# Altium schematic sheet Sheet1.SchDoc
size Letter; SheetNumber: 1; SheetTotal: 5
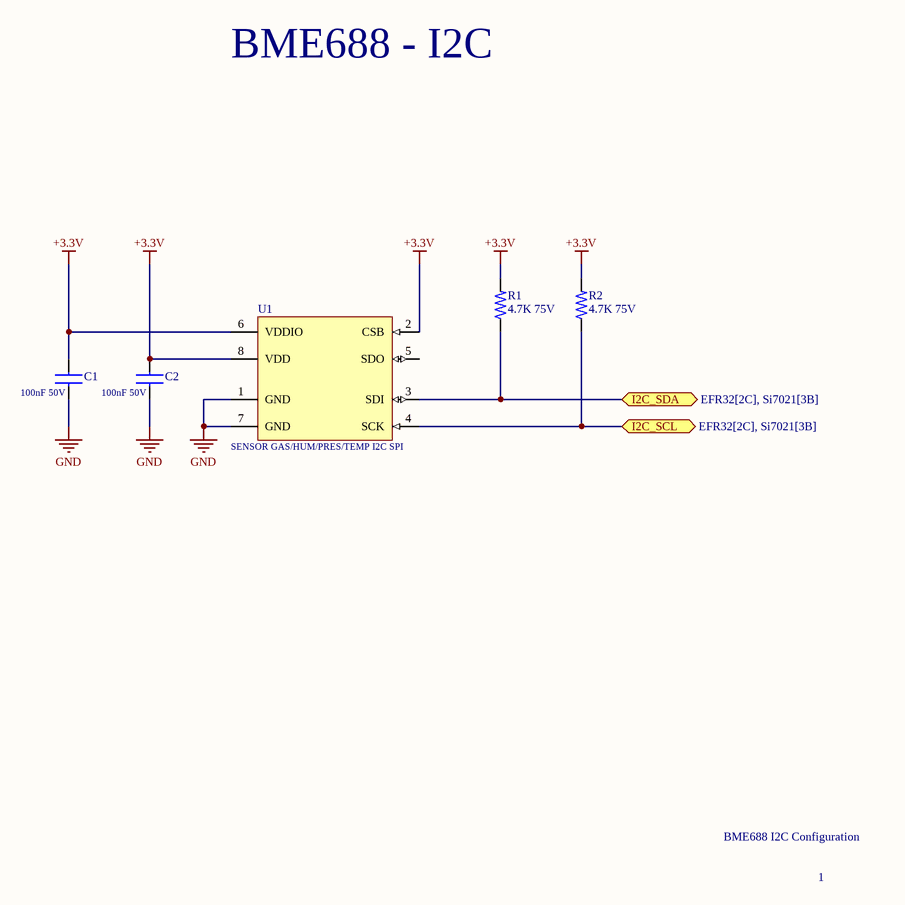
[diagram p0: Sheet1.SchDoc]

## Parts
C1  100nF 50V  [CAP_0603_1MM]
C2  100nF 50V  [CAP_0603_1MM]
R1  4.7K 75V  [RES_0603_1608X06]
R2  4.7K 75V  [RES_0603_1608X06]
U1  SENSOR GAS/HUM/PRES/TEMP I2C SPI  [LGA_8_300X300X100]

## Ports
I2C_SCL (bidir, see EFR32[2C], Si7021[3B]), I2C_SDA (bidir, see EFR32[2C], Si7021[3B])

## Nets
+3.3V: C1.1 C2.1 R1.2 R2.2 U1.2(CSB) U1.6(VDDIO) U1.8(VDD)
GND: C1.2 C2.2 U1.1(GND) U1.7(GND)
I2C_SCL: R2.1 U1.4(SCK) ; port I2C_SCL
I2C_SDA: R1.1 U1.3(SDI) ; port I2C_SDA

Not connected (* = marked no-connect by the designer): U1 5(SDO)

## Notes on the sheet
- BME688 - I2C
- BME688 I2C Configuration
- 1

## Library data of the parts
C1 C2 = CC0603ZRY5V9BB104: Ceramic Capacitor, Multilayer, Ceramic, 50V, 80% +Tol, 20% -Tol, Y5V, -82/+22% TC, 0.1uF, Surface Mount, 0603; Manufacturer: Yageo; Multilayer: Yes; Supplier: Digikey; Supplier Part Number: 311-1343-1-ND; Manufacturer Part Number: CC0603ZRY5V9BB104; RoHS: Yes; Category: Ceramic Capacitors; Stock: 7870307; Pricing: 1=0.1, 10=0.028, 50=0.0162, 100=0.0125, 500=0.00944, 1000=0.00742 (USD); Mounting Technology: Surface Mount; Pins: 2; Dielectric Material: Ceramic; Package Shape: Rectangular; Case/Package: 0603; Terminal Finish: Nickel; Min Operating Temperature: -30°C; Max Operating Temperature: 85°C; JESD-609 Code: e3; Value: 100nF; Capacitor Type: Ceramic; Tolerance  (fill in as +-): 20%; Package Style: SMTMeter; Packaging: Tape and Reel; Tolerance (fill in as +-): 80%; Rated DC Voltage (URdc): 50V; Temperature Characteristics Code: Y5V; Termination: Wraparound; Length: 1.6mm; Width: 0.8mm; Height: 0.8mm; Reach SVHC Compliant: Yes; RoHS Compliant: Yes; ComponentLink1URL: https://datasheet.ciiva.com:443/pdfs/VipMasterIC/IC/YAGO/YAGO-S-A0004841839/YAGO-S-A0004841839-1.pdf?src-supplier=IHS+Markit; ComponentLink1Description: https://datasheet.ciiva.com:443/pdfs/VipMasterIC/IC/YAGO/YAGO-S-A0004841839/YAGO-S-A0004841839-1.pdf?src-supplier=IHS+Markit; ComponentLink2URL: https://datasheet.ciiva.com/144/mlccorderingcode-144027.pdf?src-supplier=Digikey; ComponentLink2Description: https://datasheet.ciiva.com/144/mlccorderingcode-144027.pdf?src-supplier=Digikey; ComponentLink3URL: https://datasheet.ciiva.com/11786/0900766b8079c870-11786029.pdf?src-supplier=Rs; ComponentLink3Description: https://datasheet.ciiva.com/11786/0900766b8079c870-11786029.pdf?src-supplier=Rs; ComponentLink4URL: https://datasheet.ciiva.com/144/mlccorderingcode-144025.pdf?src-supplier=Digikey; ComponentLink4Description: https://datasheet.ciiva.com/144/mlccorderingcode-144025.pdf?src-supplier=Digikey; ComponentLink5URL: https://datasheet.ciiva.com/144/mlccorderingcode-144026.pdf?src-supplier=Digikey; ComponentLink5Description: https://datasheet.ciiva.com/144/mlccorderingcode-144026.pdf?src-supplier=Digikey; ComponentLink6URL: https://datasheet.ciiva.com/5427/upy-gphc-y5v-6-3v-to-50v-5-5427420.pdf?src-supplier=Mouser; ComponentLink6Description: https://datasheet.ciiva.com/5427/upy-gphc-y5v-6-3v-to-50v-5-5427420.pdf?src-supplier=Mouser; ComponentLink7URL: https://datasheet.ciiva.com/28450/1132289-28450702.pdf?src-supplier=Element14; ComponentLink7Description: https://datasheet.ciiva.com/28450/1132289-28450702.pdf?src-supplier=Element14; ComponentLink8URL: https://datasheet.ciiva.com/26829/getdatasheetpartid-403611-26829467.pdf?src-supplier=Verical; ComponentLink8Description: https://datasheet.ciiva.com/26829/getdatasheetpartid-403611-26829467.pdf?src-supplier=Verical
R1 R2 = RMCF0603FT4K70: Fixed Resistor, Metal Glaze/thick Film, 0.1W, 4700ohm, 75V, 1% +/-Tol, 100ppm/Cel, Surface Mount, 0603; Manufacturer: Stackpole Electronics; Power: 100mW; Rated Temperature: 70°C; Value: 4.7kR; Temperature Coefficient: 100ppm/°C; Package Height: 0.45mm; Package Length: 1.55mm; Package Width: 0.8mm; Reference Standard: AEC-Q200; Supplier: Digikey; Supplier Part Number: RMCF0603FT4K70CT-ND; Manufacturer Part Number: RMCF0603FT4K70; RoHS: Yes; Category: Chip SMD Resistors; Stock: 2225898; Pricing: 1=0.1, 10=0.015, 50=0.009, 100=0.0075, 500=0.00498, 1000=0.00425 (USD); Mounting Technology: Surface Mount; Pins: 2; Package Shape: Rectangular; Case/Package: 0603; Terminal Finish: Nickel; Min Operating Temperature: -55°C; Max Operating Temperature: 155°C; Tolerance: 1%; JESD-609 Code: e3; Resistor Type: FIXED RESISTOR; Construction: Rectangular; Package Style: SMTMeter; Packaging: Tape and Reel; Technology: METAL GLAZE/THICK FILM; Termination: Wraparound; Working Voltage: 75V; Reach SVHC Compliant: Yes; RoHS Compliant: Yes; ComponentLink1URL: https://datasheet.ciiva.com:443/pdfs/VipMasterIC/IC/SEIE/SEIE-S-A0009541969/SEIE-S-A0009541969-1.pdf?src-supplier=IHS+Markit; ComponentLink1Description: https://datasheet.ciiva.com:443/pdfs/VipMasterIC/IC/SEIE/SEIE-S-A0009541969/SEIE-S-A0009541969-1.pdf?src-supplier=IHS+Markit; ComponentLink2URL: https://datasheet.ciiva.com/26835/getdatasheetpartid-486078-26835642.pdf?src-supplier=Verical; ComponentLink2Description: https://datasheet.ciiva.com/26835/getdatasheetpartid-486078-26835642.pdf?src-supplier=Verical
U1 = BME688: Gas, Pressure, Temperature and Humidity Sensor Digital Output 1.8V 8-Pin LGA Reel; Manufacturer: Bosch Tools; Supplier: Digikey; Supplier Part Number: 828-BME688CT-ND; Manufacturer Part Number: BME688; RoHS: No; Category: Temperature and Humidity Sensors; Stock: 11321; Pricing: 1=11.83, 10=9.466, 25=8.756, 100=7.5729, 500=7.0996, 1000=6.6263, 6000=6.29499 (USD)